# Altium schematic sheet shiftReg1.SchDoc
size A4; SheetNumber: 3; SheetTotal: 4
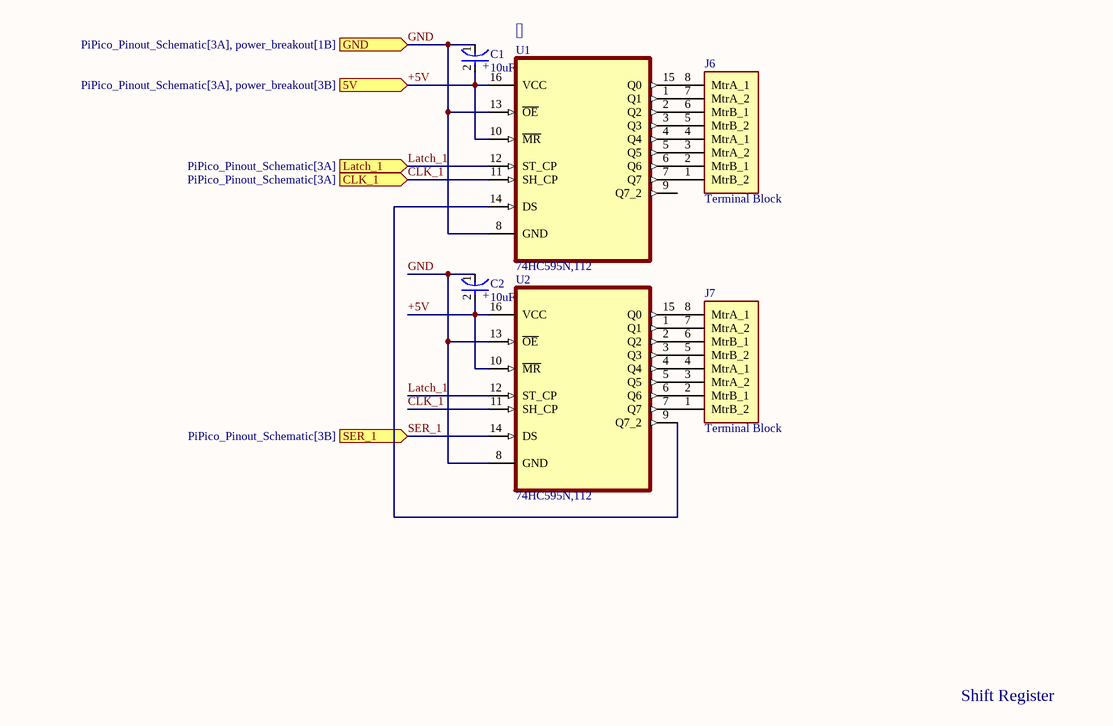
[diagram p0: shiftReg1.SchDoc]

## Parts
C1  10uF  [FP-TAP106K016SCS-MFG]
C2  10uF  [FP-TAP106K016SCS-MFG]
J6  Terminal Block  [TE_282834-8]
J7  Terminal Block  [TE_282834-8]
U1  74HC595N,112  [DIP254P762X420-16]
U2  74HC595N,112  [DIP254P762X420-16]

## Ports
5V (in, see PiPico_Pinout_Schematic[3A], power_breakout[3B]), CLK_1 (in, see PiPico_Pinout_Schematic[3A]), GND (in, see PiPico_Pinout_Schematic[3A], power_breakout[1B]), Latch_1 (in, see PiPico_Pinout_Schematic[3A]), SER_1 (in, see PiPico_Pinout_Schematic[3B])

## Nets
+5V: C1.2(A) C2.2(A) U1.10(~{MR}) U1.16(VCC) U2.10(~{MR}) U2.16(VCC) ; port 5V
CLK_1: U1.11(SH_CP) U2.11(SH_CP) ; port CLK_1
GND: C1.1(C) C2.1(C) U1.8(GND) U1.13(~{OE}) U2.8(GND) U2.13(~{OE}) ; port GND
Latch_1: U1.12(ST_CP) U2.12(ST_CP) ; port Latch_1
SER_1: U2.14(DS) ; port SER_1
NetJ6_1: J6.1(MtrB_2) U1.7(Q7)
NetJ6_2: J6.2(MtrB_1) U1.6(Q6)
NetJ6_3: J6.3(MtrA_2) U1.5(Q5)
NetJ6_4: J6.4(MtrA_1) U1.4(Q4)
NetJ6_5: J6.5(MtrB_2) U1.3(Q3)
NetJ6_6: J6.6(MtrB_1) U1.2(Q2)
NetJ6_7: J6.7(MtrA_2) U1.1(Q1)
NetJ6_8: J6.8(MtrA_1) U1.15(Q0)
NetJ7_1: J7.1(MtrB_2) U2.7(Q7)
NetJ7_2: J7.2(MtrB_1) U2.6(Q6)
NetJ7_3: J7.3(MtrA_2) U2.5(Q5)
NetJ7_4: J7.4(MtrA_1) U2.4(Q4)
NetJ7_5: J7.5(MtrB_2) U2.3(Q3)
NetJ7_6: J7.6(MtrB_1) U2.2(Q2)
NetJ7_7: J7.7(MtrA_2) U2.1(Q1)
NetJ7_8: J7.8(MtrA_1) U2.15(Q0)
NetU1_14: U1.14(DS) U2.9(Q7_2)

Not connected (* = marked no-connect by the designer): U1 9(Q7_2)

## Notes on the sheet
- 
- Shift Register
- (in symbol CMP-04424-000616-1) +

## Library data of the parts
C1 C2 = CMP-04424-000616-1: CAP TANT 10UF 10% 16V RADIAL; Dissipation Factor: 8%; Dielectric Material: Tantalum; Leakage Current: 1.2uA; Polarity: Polar; Life (Hours): 1000Hour; ESR (Equivalent Series Resistance): 3.2R; Lead Diameter: 0.5mm; Packaging: Bulk; Min Operating Temperature: -55°C; RoHS Compliant: Yes; Construction: RADIAL; Length: 9mm; Number of Pins: 2; Height - Seated (Max): 0.354inch; Termination: Radial; Tolerance: 10%; Case/Package: Dipped; Voltage Rating (DC): 16V; Voltage Rating: 16V; Lead Pitch: 2.5mm; Size: 9mm; Voltage: 16V; Lead Free: Lead Free; Mount: Through Hole; Height: 9mm; Max Operating Temperature: 125°C; Features: General Purpose; Diameter: 5mm; Radiation Hardening: No; Package Quantity: 1000; Series: TAP; Capacitance: 10uF
J6 J7 = 282834-8: Buchanan; Conn; Term Blk; PCB; 8; 2.54mm; Front; 30-16 AWG; Green; 10 A; 150 V; MF: TE Connectivity; SnapEDA_Link: https://www.snapeda.com/parts/282834-8/TE+Connectivity+AMP+Connectors/view-part/?ref=snap; Purchase-URL: https://pricing.snapeda.com/search/part/282834-8/?ref=eda; Value: *; Digi-Key_Part_Number: A98338-ND; Package: None; Check_prices: https://www.snapeda.com/parts/282834-8/TE+Connectivity+AMP+Connectors/view-part/?ref=eda; MP: 282834-8
U1 U2 = 74HC595N,112: Shift Shift Register 1 Element 8 Bit 16-DIP; MF: NXP USA; Purchase-URL: https://pricing.snapeda.com/search/part/74HC595N,112/?ref=eda; Package: SOT38-4-16 Nexperia; Value: *; Check_prices: https://www.snapeda.com/parts/74HC595N,112/NXP+USA+Inc./view-part/?ref=eda; SnapEDA_Link: https://www.snapeda.com/parts/74HC595N,112/NXP+USA+Inc./view-part/?ref=snap; Availability: In Stock; Price: None; MP: 74HC595N,112